# Altium schematic sheet 光圈图纸.SchDoc
size A4
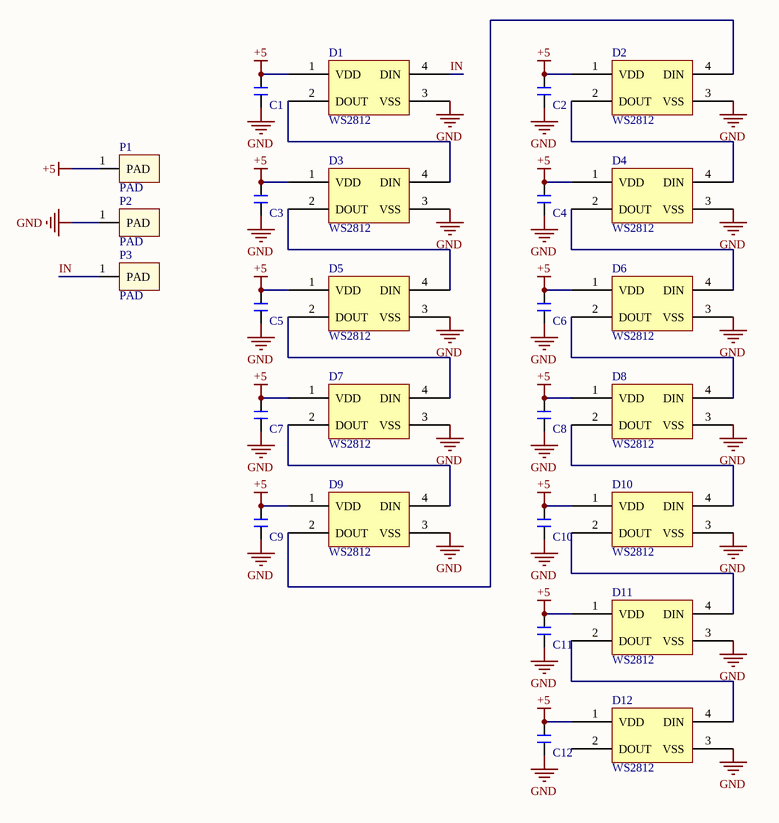
[diagram p0: 光圈图纸.SchDoc]

## Parts
C1  cap  [0603c]  (value not drawn)
C2  cap  [0603c]  (value not drawn)
C3  cap  [0603c]  (value not drawn)
C4  cap  [0603c]  (value not drawn)
C5  cap  [0603c]  (value not drawn)
C6  cap  [0603c]  (value not drawn)
C7  cap  [0603c]  (value not drawn)
C8  cap  [0603c]  (value not drawn)
C9  cap  [0603c]  (value not drawn)
C10  cap  [0603c]  (value not drawn)
C11  cap  [0603c]  (value not drawn)
C12  cap  [0603c]  (value not drawn)
D1  WS2812  [WS2812]
D2  WS2812  [WS2812]
D3  WS2812  [WS2812]
D4  WS2812  [WS2812]
D5  WS2812  [WS2812]
D6  WS2812  [WS2812]
D7  WS2812  [WS2812]
D8  WS2812  [WS2812]
D9  WS2812  [WS2812]
D10  WS2812  [WS2812]
D11  WS2812  [WS2812]
D12  WS2812  [WS2812]
P1  PAD  [PAD]
P2  PAD  [PAD]
P3  PAD  [PAD]

## Nets
+5: C1.2 C2.2 C3.2 C4.2 C5.2 C6.2 C7.2 C8.2 C9.2 C10.2 C11.2 C12.2 D1.1(VDD) D2.1(VDD) D3.1(VDD) D4.1(VDD) D5.1(VDD) D6.1(VDD) D7.1(VDD) D8.1(VDD) D9.1(VDD) D10.1(VDD) D11.1(VDD) D12.1(VDD) P1.1(PAD)
GND: C1.1 C2.1 C3.1 C4.1 C5.1 C6.1 C7.1 C8.1 C9.1 C10.1 C11.1 C12.1 D1.3(VSS) D2.3(VSS) D3.3(VSS) D4.3(VSS) D5.3(VSS) D6.3(VSS) D7.3(VSS) D8.3(VSS) D9.3(VSS) D10.3(VSS) D11.3(VSS) D12.3(VSS) P2.1(PAD)
IN: D1.4(DIN) P3.1(PAD)
NetD1_2: D1.2(DOUT) D3.4(DIN)
NetD2_2: D2.2(DOUT) D4.4(DIN)
NetD2_4: D2.4(DIN) D9.2(DOUT)
NetD3_2: D3.2(DOUT) D5.4(DIN)
NetD4_2: D4.2(DOUT) D6.4(DIN)
NetD5_2: D5.2(DOUT) D7.4(DIN)
NetD6_2: D6.2(DOUT) D8.4(DIN)
NetD7_2: D7.2(DOUT) D9.4(DIN)
NetD8_2: D8.2(DOUT) D10.4(DIN)
NetD10_2: D10.2(DOUT) D11.4(DIN)
NetD11_2: D11.2(DOUT) D12.4(DIN)

Not connected (* = marked no-connect by the designer): D12 2(DOUT)